# EAGLE design 2022-LPC2148_Piggyback_V1 (EAGLE 6.1)

## Sheet 1 of 3
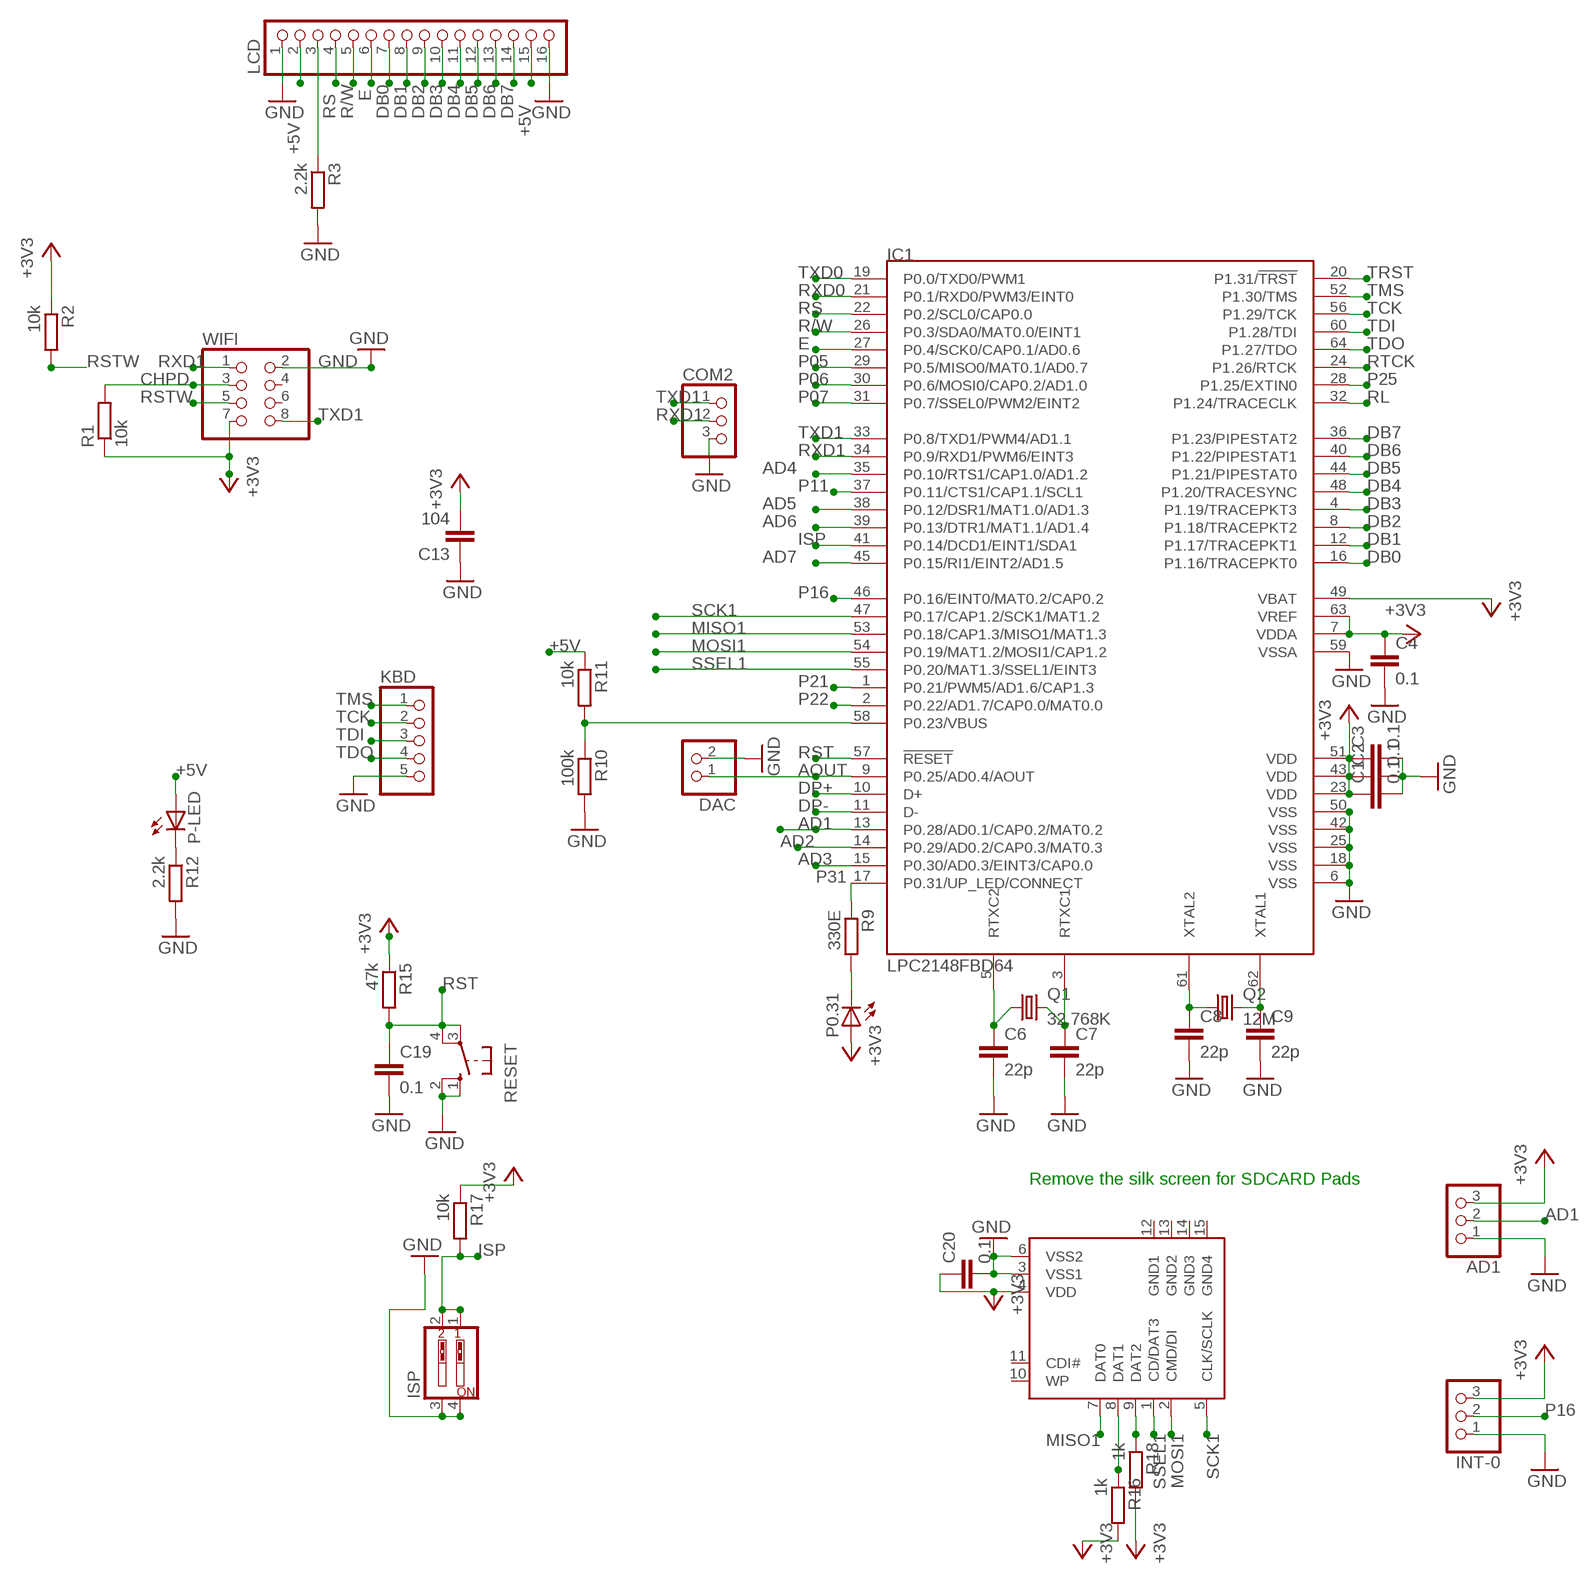
[diagram p0: schematic, sheet 1]

### Parts
AD1  PINHD-1X3  [1X03]
C1  0.1  C-EUC1206  [C1206]
C2  0.1  C-EUC1206  [C1206]
C3  0.1  C-EUC1206  [C1206]
C4  0.1  C-EUC1206  [C1206]
C6  22p  C-EUC1206  [C1206]
C7  22p  C-EUC1206  [C1206]
C8  22p  C-EUC1206  [C1206]
C9  22p  C-EUC1206  [C1206]
C13  104  C-EUC1206  [C1206]
C19  0.1  C-EUC1206  [C1206]
C20  0.1  C-EUC1206  [C1206]
COM2  PINHD-1X3  [1X03]
DAC  PINHD-1X2  [1X02]
IC1  LPC2148FBD64  [TSQFP50P1200X1200X160-64N]
INT-0  PINHD-1X3  [1X03]
ISP  SW_DIP-2  [EDG-02]
KBD  PINHD-1X5  [1X05]
LCD  PINHD-1X16  [1X16]
P0.31  LEDCHIPLED_1206  [CHIPLED_1206]
P-LED  LEDCHIPLED_1206  [CHIPLED_1206]
Q1  32.768K  CRYSTALTC26H  [TC26H]
Q2  12M  CRYSTALHC49U70  [HC49U70]
R1  10k  R-EU_R1206  [R1206]
R2  10k  R-EU_R1206  [R1206]
R3  2.2k  R-EU_R1206  [R1206]
R9  330E  R-EU_R1206  [R1206]
R10  100k  R-EU_R1206  [R1206]
R11  10k  R-EU_R1206  [R1206]
R12  2.2k  R-EU_R1206  [R1206]
R15  47k  R-EU_R1206  [R1206]
R16  1k  R-EU_R1206  [R1206]
R17  10k  R-EU_R1206  [R1206]
R18  1k  R-EU_R1206  [R1206]
RESET  10-XX  [B3F-10XX]
SD  SDCARDVAR2  [SDCMF-10915W010]
WIFI  PINHD-2X4  [2X04]

### Nets
+3V3: AD1.3 C1.1 C2.1 C3.1 C4.1 C13.2 C20.1 IC1.7(VDDA) IC1.23(VDD) IC1.43(VDD) IC1.49(VBAT) IC1.51(VDD) IC1.63(VREF) INT-0.3 P0.31.A R1.1 R2.1 R15.1 R16.2 R17.1 R18.2 SD.4(VDD) WIFI.7 ; also sheet 2,3
+5V: LCD.2 LCD.15 P-LED.A R11.1 ; also sheet 2,3
AD1: AD1.2 IC1.13(P0.28/AD0.1/CAP0.2/MAT0.2) ; also sheet 2
AD2: IC1.14(P0.29/AD0.2/CAP0.3/MAT0.3) ; also sheet 2
AD3: IC1.15(P0.30/AD0.3/EINT3/CAP0.0) ; also sheet 2
AD4: IC1.35(P0.10/RTS1/CAP1.0/AD1.2) ; also sheet 2
AD5: IC1.38(P0.12/DSR1/MAT1.0/AD1.3) ; also sheet 2
AD6: IC1.39(P0.13/DTR1/MAT1.1/AD1.4) ; also sheet 2
AD7: IC1.45(P0.15/RI1/EINT2/AD1.5) ; also sheet 2
AOUT: DAC.1 IC1.9(P0.25/AD0.4/AOUT)
CHPD: R1.2 WIFI.3
DB0: IC1.16(P1.16/TRACEPKT0) LCD.7 ; also sheet 2
DB1: IC1.12(P1.17/TRACEPKT1) LCD.8 ; also sheet 2
DB2: IC1.8(P1.18/TRACEPKT2) LCD.9 ; also sheet 2
DB3: IC1.4(P1.19/TRACEPKT3) LCD.10 ; also sheet 2
DB4: IC1.48(P1.20/TRACESYNC) LCD.11 ; also sheet 2
DB5: IC1.44(P1.21/PIPESTAT0) LCD.12 ; also sheet 2
DB6: IC1.40(P1.22/PIPESTAT1) LCD.13 ; also sheet 2
DB7: IC1.36(P1.23/PIPESTAT2) LCD.14 ; also sheet 2
DP+: IC1.10(D+) ; also sheet 2
DP-: IC1.11(D-) ; also sheet 2
E: IC1.27(P0.4/SCK0/CAP0.1/AD0.6) LCD.6 ; also sheet 2
GND: AD1.1 C1.2 C2.2 C3.2 C4.2 C6.2 C7.2 C8.2 C9.2 C13.1 C19.2 C20.2 COM2.3 DAC.2 IC1.6(VSS) IC1.18(VSS) IC1.25(VSS) IC1.42(VSS) IC1.50(VSS) IC1.59(VSSA) INT-0.1 ISP.3 ISP.4 KBD.5 LCD.1 LCD.16 R3.2 R10.2 R12.2 RESET.1(S) RESET.2(S1) SD.3(VSS1) SD.6(VSS2) WIFI.2 ; also sheet 2,3
ISP: IC1.41(P0.14/DCD1/EINT1/SDA1) ISP.1 ISP.2 R17.2
MISO1: IC1.53(P0.18/CAP1.3/MISO1/MAT1.3) SD.7(DAT0)
MOSI1: IC1.54(P0.19/MAT1.2/MOSI1/CAP1.2) SD.2(CMD/DI)
N$1: C6.1 IC1.5(RTXC2) Q1.1
N$2: C7.1 IC1.3(RTXC1) Q1.2
N$4: C8.1 IC1.61(XTAL2) Q2.1
N$5: C9.1 IC1.62(XTAL1) Q2.2
N$7: P0.31.C R9.2
N$8: P-LED.C R12.1
N$13: IC1.58(P0.23/VBUS) R10.1 R11.2
N$18: LCD.3 R3.1
N$20: R18.1 SD.9(DAT2)
N$25: R16.1 SD.8(DAT1)
P05: IC1.29(P0.5/MISO0/MAT0.1/AD0.7) ; also sheet 2
P06: IC1.30(P0.6/MOSI0/CAP0.2/AD1.0) ; also sheet 2
P07: IC1.31(P0.7/SSEL0/PWM2/EINT2) ; also sheet 2
P11: IC1.37(P0.11/CTS1/CAP1.1/SCL1) ; also sheet 2
P16: IC1.46(P0.16/EINT0/MAT0.2/CAP0.2) INT-0.2
P21: IC1.1(P0.21/PWM5/AD1.6/CAP1.3) ; also sheet 2
P22: IC1.2(P0.22/AD1.7/CAP0.0/MAT0.0) ; also sheet 2
P25: IC1.28(P1.25/EXTIN0) ; also sheet 2
P31: IC1.17(P0.31/UP_LED/CONNECT) R9.1
R/W: IC1.26(P0.3/SDA0/MAT0.0/EINT1) LCD.5
RL: IC1.32(P1.24/TRACECLK) ; also sheet 2
RS: IC1.22(P0.2/SCL0/CAP0.0) LCD.4 ; also sheet 2
RST: C19.1 IC1.57(!RESET) R15.2 RESET.3(P) RESET.4(P1)
RSTW: R2.2 WIFI.5
RTCK: IC1.24(P1.26/RTCK) ; also sheet 2
RXD0: IC1.21(P0.1/RXD0/PWM3/EINT0) ; also sheet 2,3
RXD1: COM2.2 IC1.34(P0.9/RXD1/PWM6/EINT3) WIFI.1
SCK1: IC1.47(P0.17/CAP1.2/SCK1/MAT1.2) SD.5(CLK/SCLK)
SSEL1: IC1.55(P0.20/MAT1.3/SSEL1/EINT3) SD.1(CD/DAT3)
TCK: IC1.56(P1.29/TCK) KBD.2 ; also sheet 2
TDI: IC1.60(P1.28/TDI) KBD.3 ; also sheet 2
TDO: IC1.64(P1.27/TDO) KBD.4 ; also sheet 2
TMS: IC1.52(P1.30/TMS) KBD.1 ; also sheet 2
TRST: IC1.20(P1.31/!TRST) ; also sheet 2
TXD0: IC1.19(P0.0/TXD0/PWM1) ; also sheet 2,3
TXD1: COM2.1 IC1.33(P0.8/TXD1/PWM4/AD1.1) WIFI.8
Unconnected: SD.10(WP) SD.11(CDI#) WIFI.4 WIFI.6

### Notes on the sheet
- Remove the silk screen for SDCARD Pads

## Sheet 2 of 3
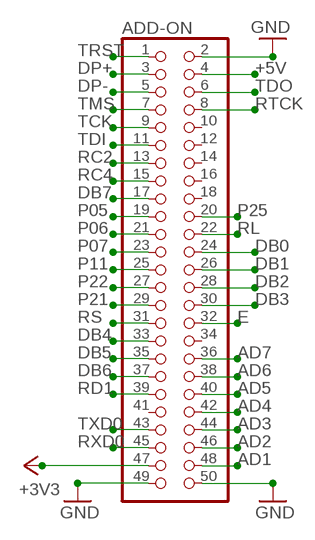
[diagram p1: schematic, sheet 2]

### Parts
ADD-ON  PINHD-2X25  [2X25]

### Nets
+3V3: ADD-ON.47 ; also sheet 1,3
+5V: ADD-ON.4 ; also sheet 1,3
AD1: ADD-ON.48 ; also sheet 1
AD2: ADD-ON.46 ; also sheet 1
AD3: ADD-ON.44 ; also sheet 1
AD4: ADD-ON.42 ; also sheet 1
AD5: ADD-ON.40 ; also sheet 1
AD6: ADD-ON.38 ; also sheet 1
AD7: ADD-ON.36 ; also sheet 1
DB0: ADD-ON.24 ; also sheet 1
DB1: ADD-ON.26 ; also sheet 1
DB2: ADD-ON.28 ; also sheet 1
DB3: ADD-ON.30 ; also sheet 1
DB4: ADD-ON.33 ; also sheet 1
DB5: ADD-ON.35 ; also sheet 1
DB6: ADD-ON.37 ; also sheet 1
DB7: ADD-ON.17 ; also sheet 1
DP+: ADD-ON.3 ; also sheet 1
DP-: ADD-ON.5 ; also sheet 1
E: ADD-ON.32 ; also sheet 1
GND: ADD-ON.2 ADD-ON.49 ADD-ON.50 ; also sheet 1,3
P05: ADD-ON.19 ; also sheet 1
P06: ADD-ON.21 ; also sheet 1
P07: ADD-ON.23 ; also sheet 1
P11: ADD-ON.25 ; also sheet 1
P21: ADD-ON.29 ; also sheet 1
P22: ADD-ON.27 ; also sheet 1
P25: ADD-ON.20 ; also sheet 1
RC2: ADD-ON.13
RC4: ADD-ON.15
RD1: ADD-ON.39
RL: ADD-ON.22 ; also sheet 1
RS: ADD-ON.31 ; also sheet 1
RTCK: ADD-ON.8 ; also sheet 1
RXD0: ADD-ON.45 ; also sheet 1,3
TCK: ADD-ON.9 ; also sheet 1
TDI: ADD-ON.11 ; also sheet 1
TDO: ADD-ON.6 ; also sheet 1
TMS: ADD-ON.7 ; also sheet 1
TRST: ADD-ON.1 ; also sheet 1
TXD0: ADD-ON.43 ; also sheet 1,3
Unconnected: ADD-ON.10 ADD-ON.12 ADD-ON.14 ADD-ON.16 ADD-ON.18 ADD-ON.34 ADD-ON.41

## Sheet 3 of 3
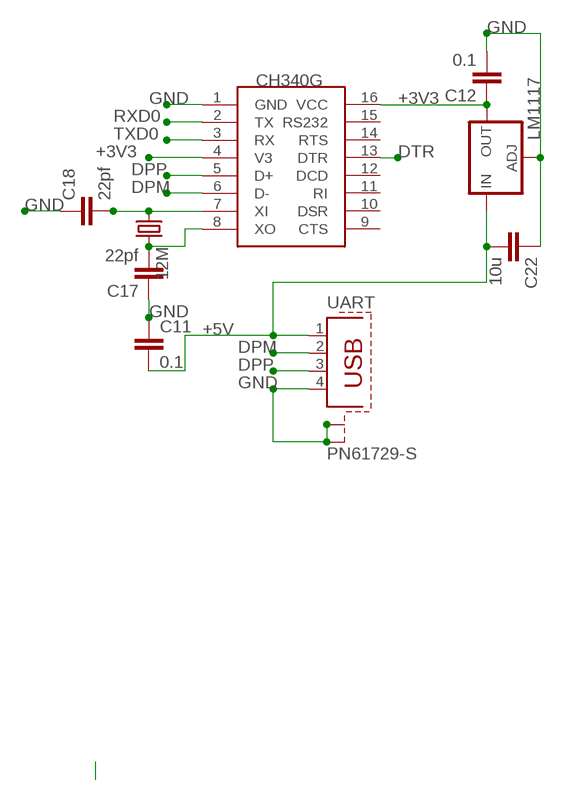
[diagram p2: schematic, sheet 3]

### Parts
12M  CRYSTALHC18U-V  [HC18U-V]
C11  0.1  C-EUC1206  [C1206]
C12  0.1  C-EUC1206  [C1206]
C17  22pf  C-EUC1206  [C1206]
C18  22pf  C-EUC1206  [C1206]
C22  10u  C-EUC1206  [C1206]
LM1117  LD117AS18TR  [SOT223]
U$1  CH340G  [SOIC16]
UART  PN61729-S  [PN61729-S]

### Nets
+3V3: C12.1 LM1117.4(OUT) U$1.4(V3) U$1.16(VCC) ; also sheet 1,2
+5V: C11.2 C22.2 LM1117.3(IN) UART.1 ; also sheet 1,2
DPM: U$1.6(D-) UART.2
DPP: U$1.5(D+) UART.3
DTR: U$1.13(DTR)
GND: C11.1 C12.2 C17.1 C18.1 C22.1 LM1117.1(ADJ) U$1.1(GND) UART.4 UART.S1 UART.S2 ; also sheet 1,2
N$10: 12M.2 C17.2 U$1.8(XO)
N$14: 12M.1 C18.2 U$1.7(XI)
RXD0: U$1.2(TX) ; also sheet 1,2
TXD0: U$1.3(RX) ; also sheet 1,2
Unconnected: U$1.9(CTS) U$1.10(DSR) U$1.11(RI) U$1.12(DCD) U$1.14(RTS) U$1.15(RS232)

## Power pins joined to a net without a drawn wire
GND1: SD.12(GND1)
GND2: SD.13(GND2)
GND3: SD.14(GND3)
GND4: SD.15(GND4)

## Library data of the parts
12M Q1 Q2 = crystal:CRYSTAL: CRYSTAL; OC_FARNELL: unknown; OC_NEWARK: unknown
AD1 COM2 INT-0 = pinhead:PINHD-1X3: PIN HEADER
ADD-ON = pinhead:PINHD-2X25: PIN HEADER
C1-C4 C6-C9 C11-C13 C17-C20 C22 = resistor:C-EU: CAPACITOR, European symbol
DAC = pinhead:PINHD-1X2: PIN HEADER
IC1 = nxp:LPC2148
ISP = special:SW_DIP-2: DIP SWITCH
KBD = pinhead:PINHD-1X5: PIN HEADER
LCD = pinhead:PINHD-1X16: PIN HEADER
LM1117 = v-reg:LD117A?*: Low drop fixed and adjustable positive voltage regulators 1 A Source: http://www.st.com/stonline/products/literature/ds/7194/ld1117axx.pdf
P0.31 P-LED = led:LED: LED OSRAM: - CHIPLED LG R971, LG N971, LY N971, LG Q971, LY Q971, LO R971, LY R971 LH N974, LH R974 LS Q976, LO Q976, LY Q976 LO Q996 - Hyper CHIPLED LW Q18S LB Q993, LB Q99A, LB R99A - SideLED LS A670, LO A670, LY A670, LG A670, LP A670 LB A673, LV A673, LT A673, LW A673 LH A674 LY A675 LS A676, LA A676, LO A676, LY A676, LW A676 LS A679, LY A679, LG A679 - Hyper Micro SIDELED® LS Y876, LA Y876, LO Y876, LY Y876 LT Y87S - SmartLED LW L88C, LW L88S LB L89C, LB L89S, LG L890 LS L89K, LO L89K, LY L89K LS L896, LA L896, LO L896, LY L896 - TOPLED LS T670, LO T670, LY T670, LG T670, LP T670 LSG T670, LSP T670, LSY T670, LOP T670, LYG T670 LG T671, LOG T671, LSG T671 LB T673, LV T673, LT T673, LW T673 LH T674 LS T676, LA T676, LO T676, LY T676, LB T676, LH T676, LSB T676, LW T676 LB T67C, LV T67C, LT T67C, LS T67K, LO T67K, LY T67K, LW E67C LS E67B, LA E67B, LO E67B, LY E67B, LB E67C, LV E67C, LT E67C LW T67C LS T679, LY T679, LG T679 LS T770, LO T770, LY T770, LG T770, LP T770 LB T773, LV T773, LT T773, LW T773 LH T774 LS E675, LA E675, LY E675, LS T675 LS T776, LA T776, LO T776, LY T776, LB T776 LHGB T686 LT T68C, LB T68C - Hyper Mini TOPLED® LB M676 - Mini TOPLED Santana® LG M470 LS M47K, LO M47K, LY M47K Source: http://www.osram.convergy.de LUXEON: - LUMILED® LXK2-PW12-R00, LXK2-PW12-S00, LXK2-PW14-U00, LXK2-PW14-V00 LXK2-PM12-R00, LXK2-PM12-S00, LXK2-PM14-U00 LXK2-PE12-Q00, LXK2-PE12-R00, LXK2-PE12-S00, LXK2-PE14-T00, LXK2-PE14-U00 LXK2-PB12-K00, LXK2-PB12-L00, LXK2-PB12-M00, LXK2-PB14-N00, LXK2-PB14-P00, LXK2-PB14-Q00 LXK2-PR12-L00, LXK2-PR12-M00, LXK2-PR14-Q00, LXK2-PR14-R00 LXK2-PD12-Q00, LXK2-PD12-R00, LXK2-PD12-S00 LXK2-PH12-R00, LXK2-PH12-S00 LXK2-PL12-P00, LXK2-PL12-Q00, LXK2-PL12-R00 Source: www.luxeon.com KINGBRIGHT: KA-3528ASYC Source: www.kingbright.com
R1-R3 R9-R12 R15-R18 = resistor:R-EU_: RESISTOR, European symbol
RESET = switch-omron:10-XX: OMRON SWITCH; MPN: B3F-1000; OC_FARNELL: 176432; OC_NEWARK: 36M3542
SD = kingfont_sdcmf10915w010_covek:SDCARD: SD card connector KINGFONT SDCMF-10915W010
U$1 = ch340g:CH340G
UART = con-berg:PN61729-S: BERG USB connector
WIFI = pinhead:PINHD-2X4: PIN HEADER

## Board
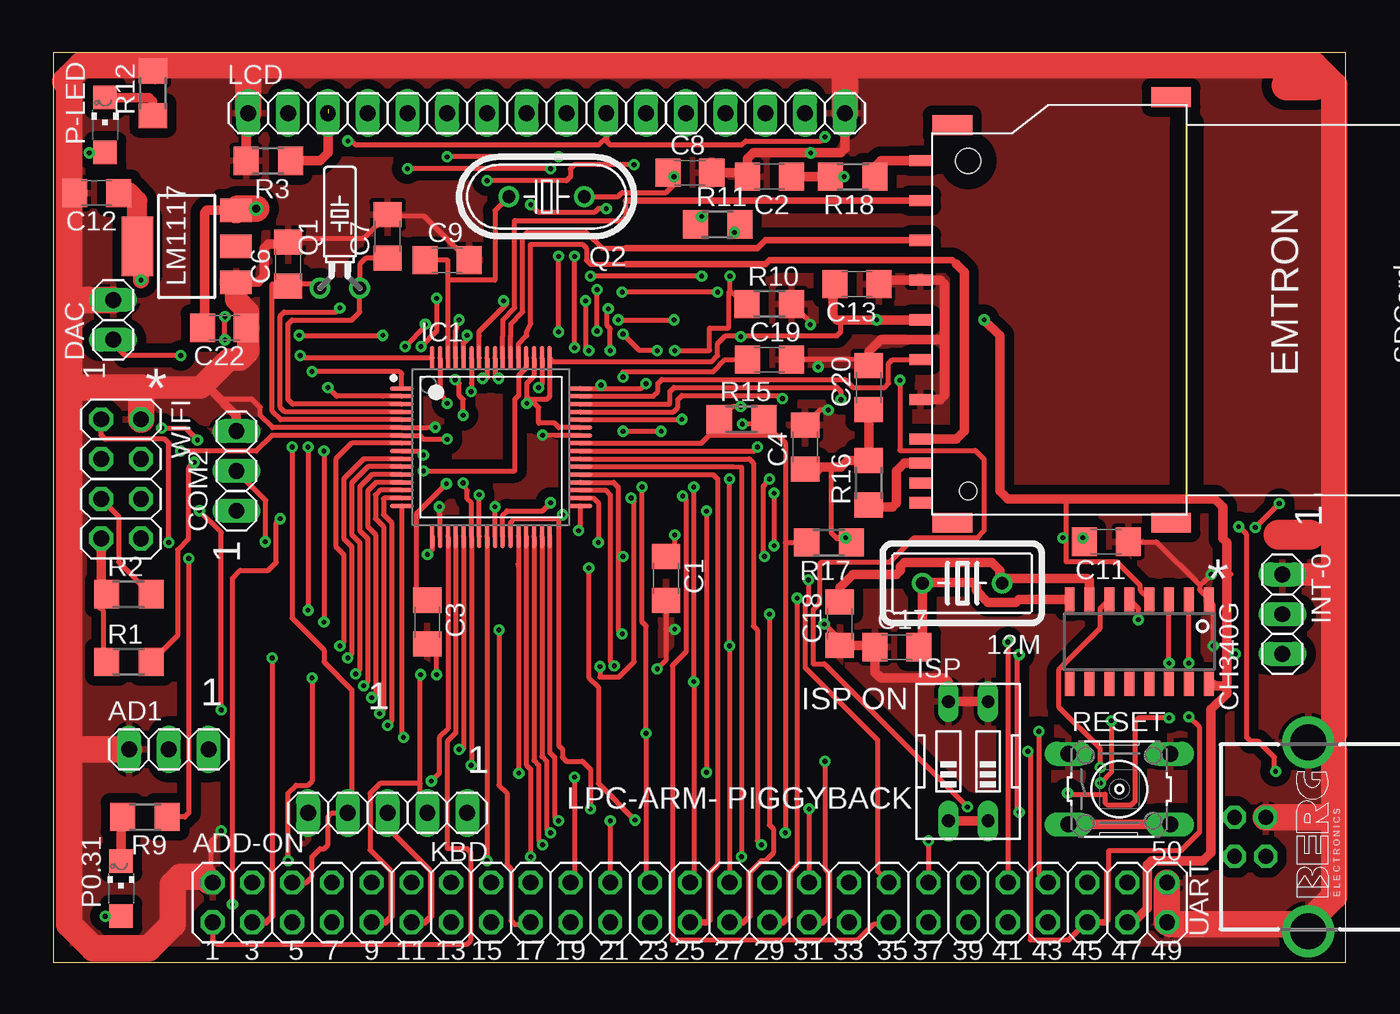
[diagram p3: board, top side]
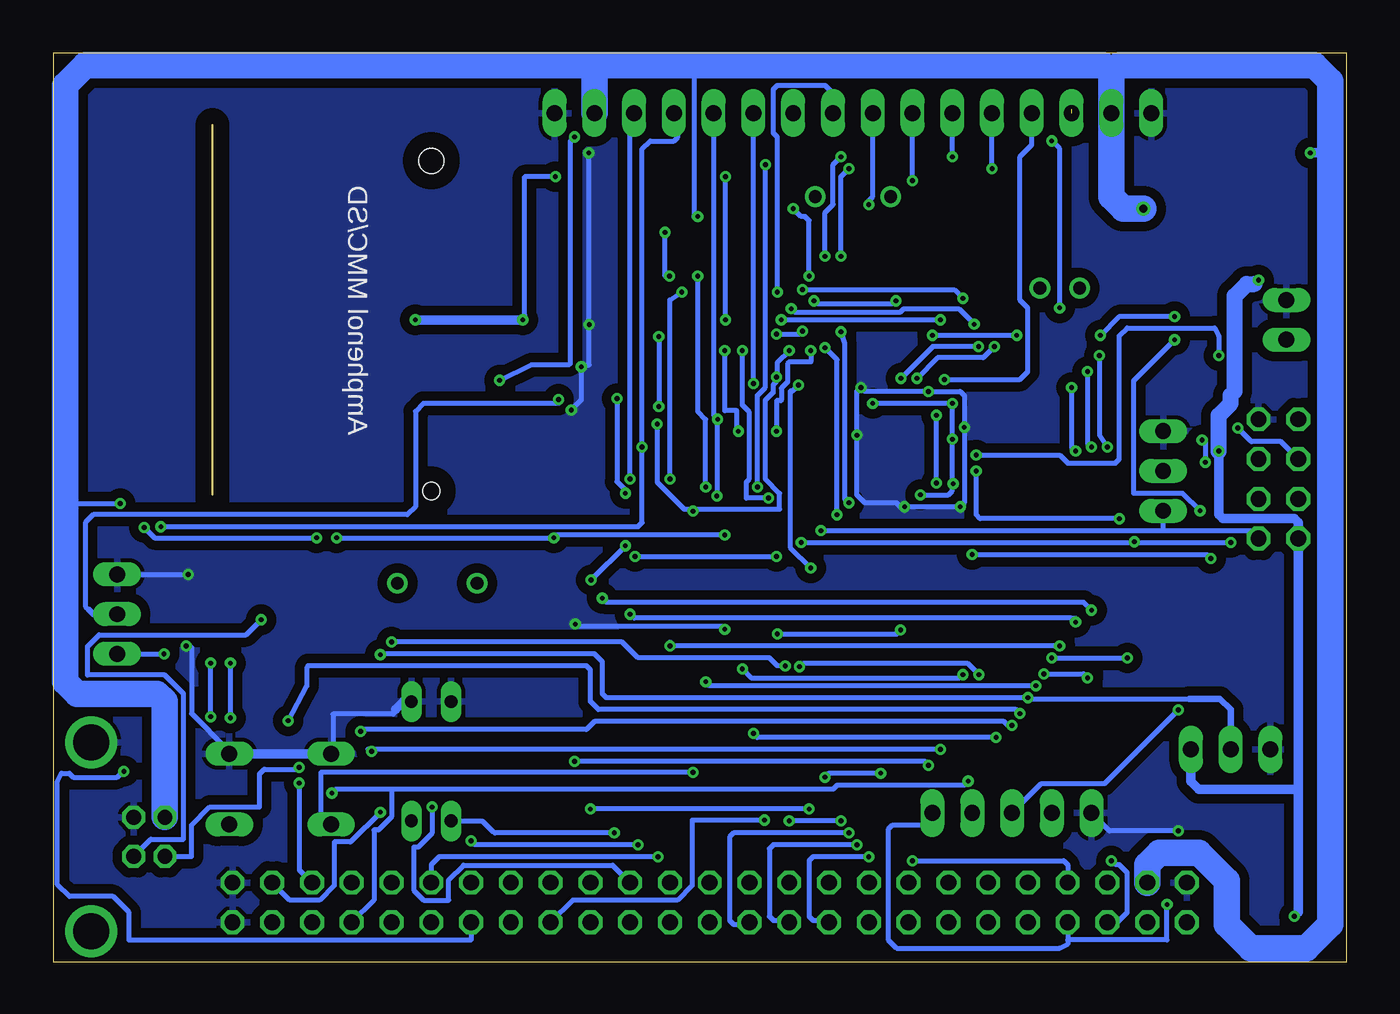
[diagram p4: board, bottom side, seen from below]

Size 82.53 x 58.09 mm. Coordinates in mm from the lower left corner, seen from the top.
Outline: 0,0 82.53,0 82.53,58.09 0,58.09 0,0
Copper layers (1*16): Top 0.035mm / dielectric 1.5mm / Bottom 0.035mm
Design rules: minimum track width 12mil, minimum drill 12mil, track to track 8mil, track to pad 8mil, pad to pad 8mil, via to via 8mil, smd to smd 8mil, copper to edge 40mil, drill to drill 8mil, minimum pad ring 10mil, minimum via ring 8mil, stop-mask expansion 4mil, vias tented up to drill 0mil, thermal gap 10mil

### Footprints (pad centres in the part's own frame; a part is rotated, then mirrored left to right if it is on the bottom)
HC18U-V = drill 0.813: 1 -2.54,0; 2 2.54,0
1X03 = drill 1.016 long: 1 -2.54,0; 2 0,0; 3 2.54,0
2X25 = drill 1.016 octagon: 1 -30.48,-1.27; 2 -30.48,1.27; 3 -27.94,-1.27; 4 -27.94,1.27; 5 -25.4,-1.27; 6 -25.4,1.27; 7 -22.86,-1.27; 8 -22.86,1.27; 9 -20.32,-1.27; 10 -20.32,1.27; 11 -17.78,-1.27; 12 -17.78,1.27; 13 -15.24,-1.27; 14 -15.24,1.27; 15 -12.7,-1.27; 16 -12.7,1.27; 17 -10.16,-1.27; 18 -10.16,1.27; 19 -7.62,-1.27; 20 -7.62,1.27; 21 -5.08,-1.27; 22 -5.08,1.27; 23 -2.54,-1.27; 24 -2.54,1.27; 25 0,-1.27; 26 0,1.27; 27 2.54,-1.27; 28 2.54,1.27; 29 5.08,-1.27; 30 5.08,1.27; 31 7.62,-1.27; 32 7.62,1.27; 33 10.16,-1.27; 34 10.16,1.27; 35 12.7,-1.27; 36 12.7,1.27; 37 15.24,-1.27; 38 15.24,1.27; 39 17.78,-1.27; 40 17.78,1.27; 41 20.32,-1.27; 42 20.32,1.27; 43 22.86,-1.27; 44 22.86,1.27; 45 25.4,-1.27; 46 25.4,1.27; 47 27.94,-1.27; 48 27.94,1.27; 49 30.48,-1.27; 50 30.48,1.27
C1206 = smd 1.6 x 1.8: 1 -1.4,0; 2 1.4,0
1X02 = drill 1.016 long: 1 -1.27,0; 2 1.27,0
TSQFP50P1200X1200X160-64N = smd 1.55 x 0.3: 1 -5.7,3.75; 2 -5.7,3.25; 3 -5.7,2.75; 4 -5.7,2.25; 5 -5.7,1.75; 6 -5.7,1.25; 7 -5.7,0.75; 8 -5.7,0.25; 9 -5.7,-0.25; 10 -5.7,-0.75; 11 -5.7,-1.25; 12 -5.7,-1.75; 13 -5.7,-2.25; 14 -5.7,-2.75; 15 -5.7,-3.25; 16 -5.7,-3.75; 33 5.7,-3.75; 34 5.7,-3.25; 35 5.7,-2.75; 36 5.7,-2.25; 37 5.7,-1.75; 38 5.7,-1.25; 39 5.7,-0.75; 40 5.7,-0.25; 41 5.7,0.25; 42 5.7,0.75; 43 5.7,1.25; 44 5.7,1.75; 45 5.7,2.25; 46 5.7,2.75; 47 5.7,3.25; 48 5.7,3.75 | smd 0.3 x 1.55: 17 -3.75,-5.7; 18 -3.25,-5.7; 19 -2.75,-5.7; 20 -2.25,-5.7; 21 -1.75,-5.7; 22 -1.25,-5.7; 23 -0.75,-5.7; 24 -0.25,-5.7; 25 0.25,-5.7; 26 0.75,-5.7; 27 1.25,-5.7; 28 1.75,-5.7; 29 2.25,-5.7; 30 2.75,-5.7; 31 3.25,-5.7; 32 3.75,-5.7; 49 3.75,5.7; 50 3.25,5.7; 51 2.75,5.7; 52 2.25,5.7; 53 1.75,5.7; 54 1.25,5.7; 55 0.75,5.7; 56 0.25,5.7; 57 -0.25,5.7; 58 -0.75,5.7; 59 -1.25,5.7; 60 -1.75,5.7; 61 -2.25,5.7; 62 -2.75,5.7; 63 -3.25,5.7; 64 -3.75,5.7
EDG-02 = drill 0.813 long: 1 -1.27,-3.81; 2 1.27,-3.81; 3 1.27,3.81; 4 -1.27,3.81
1X05 = drill 1.016 long: 1 -5.08,0; 2 -2.54,0; 3 0,0; 4 2.54,0; 5 5.08,0
1X16 = drill 1.016 long: 1 -19.05,0; 2 -16.51,0; 3 -13.97,0; 4 -11.43,0; 5 -8.89,0; 6 -6.35,0; 7 -3.81,0; 8 -1.27,0; 9 1.27,0; 10 3.81,0; 11 6.35,0; 12 8.89,0; 13 11.43,0; 14 13.97,0; 15 16.51,0; 16 19.05,0
SOT223 = smd 1.5 x 2: 1 -2.3,-3.15; 2 0,-3.15; 3 2.3,-3.15 | smd 3.8 x 2: 4 0,3.15
CHIPLED_1206 = smd 1.5 x 1.5: A 0,-1.75; C 0,1.75
TC26H = drill 0.813: 1 -1.27,0; 2 1.27,0
HC49U70 = drill 0.813: 1 -2.413,0; 2 2.413,0
R1206 = smd 1.6 x 1.803: 1 -1.422,0; 2 1.422,0
B3F-10XX = drill 1.016 long: 1 -3.251,2.261; 2 3.251,2.261; 3 -3.251,-2.261; 4 3.251,-2.261
SDCMF-10915W010 = smd 0.711 x 1.422: 1 7.366,13.462; 2 4.826,13.462; 3 2.286,13.462; 4 -0.254,13.462; 5 -2.794,13.462; 6 -5.334,13.462; 7 -7.874,13.462; 8 -9.398,13.462; 9 9.906,13.462; 10 -11.938,13.462; 11 -10.668,13.462 | smd 1.27 x 2.54: 12 12.192,11.43; 13 13.97,-2.54; 14 -13.208,-2.54; 15 -13.208,11.43 | hole 1.6: 9.906,10.414 | hole 1.1: -11.176,10.414
SOIC16 = smd 0.635 x 1.524: 1 -4.445,-2.695; 2 -3.175,-2.695; 3 -1.905,-2.695; 4 -0.635,-2.695; 5 0.635,-2.695; 6 1.905,-2.695; 7 3.175,-2.695; 8 4.445,-2.695; 9 4.445,2.695; 10 3.175,2.695; 11 1.905,2.695; 12 0.635,2.695; 13 -0.635,2.695; 14 -1.905,2.695; 15 -3.175,2.695; 16 -4.445,2.695
PN61729-S = drill 0.95 octagon: 1 1.25,4.71; 2 -1.25,4.71; 3 -1.25,2.71; 4 1.25,2.71 | drill 2.3 pad 2.9: S1 -6.02,0; S2 6.02,0
2X04 = drill 1.016 octagon: 1 -3.81,-1.27; 2 -3.81,1.27; 3 -1.27,-1.27; 4 -1.27,1.27; 5 1.27,-1.27; 6 1.27,1.27; 7 3.81,-1.27; 8 3.81,1.27

### Placement (x,y rotation side)
12M  58.04,24.21 180 top
AD1  7.37,13.59 0 top
ADD-ON  40.64,3.81 0 top
C1  39.12,24.51 270 top
C2  45.72,50.16 180 top
C3  23.88,21.72 270 top
C4  48.01,32.89 90 top
C6  14.99,44.58 90 top
C7  21.34,46.36 90 top
C8  40.64,50.42 0 top
C9  25.15,44.83 0 top
C11  67.23,26.85 180 top
C12  2.77,49.12 180 top
C13  51.31,43.31 180 top
C17  53.87,20.12 0 top
C18  50.22,21.62 90 top
C19  45.72,38.48 0 top
C20  52.07,36.7 90 top
C22  10.92,40.51 180 top
COM2  11.68,31.37 90 top
DAC  3.81,41.02 90 top
IC1  27.94,32.89 0 top
INT-0  78.49,22.23 270 top
ISP  58.42,12.83 0 top
KBD  21.34,9.52 180 top
LCD  31.5,54.23 0 top
LM1117  8.51,45.72 90 top
P0.31  4.32,4.7 0 top
P-LED  3.3,53.47 0 top
Q1  18.29,43.05 0 top
Q2  31.5,48.89 180 top
R1  4.83,19.18 0 top
R2  4.83,23.49 0 top
R3  13.72,51.18 180 top
R9  5.84,9.27 180 top
R10  45.72,42.04 0 top
R11  42.42,47.12 0 top
R12  6.35,55.5 90 top
R15  43.94,34.67 0 top
R16  52.07,30.61 90 top
R17  49.53,26.8 180 top
R18  51.05,50.16 180 top
RESET  68.07,11.05 0 top
SD  68.83,41.27 90 top
U$1  69.34,20.47 180 top
UART  80.14,8 90 top
WIFI  4.32,30.86 270 top

### Tracks (layer width: path | path; a pad name or v marks a point on that pad's centre or on a via)
+3V3  (via drill 0.3)
  Top 0.305: 17.28,33.64 IC1.7 23.36,33.64 23.37,33.66 23.62,33.4 v25.15,33.4 | 17.28,33.64 17.27,33.66 | IC1.23 27.19,29.58 v27.18,29.84 | IC1.43 32.28,34.14 32,34.42 30.99,34.42 30.99,35.43 30.48,35.94 | IC1.63 24.69,36.4 v25.15,35.69 | IC1.51 30.69,37.42 30.23,36.96 v30.23,35.69 30.35,36.02 30.48,35.94 | 30.48,35.94 31.5,35.94 31.69,36.13 IC1.49 31.7,38.58 31.75,38.48 31.89,38.34 42.02,38.34 42.42,38.73 42.42,39.5 42.93,40 43.89,40 | 43.89,40 50.04,40 50.29,40.26 50.29,40.77 50.04,41.02 | 17.28,33.64 13.96,33.64 12.95,32.64 v8.13,32.64 | 5.59,45.49 LM1117.4 | v25.09,30.56 23.16,28.63 23.16,23.85 23.88,23.14 C3.1 | R2.1 | R2.1 3.48,23.57 | v39.68,27.28 39.68,26.49 39.12,25.93 C1.1 | v50.6,27.1 50.93,27.1 50.93,26.8 R17.1 | 50.67,27.23 v50.6,27.1 | 64.67,29.59 64.67,27.1 | 64.67,27.1 64.67,25.58 67.89,25.58 69.39,24.08 69.39,23.77 69.98,23.19 U$1.4 | v43.89,35.48 43.36,35.48 42.55,34.67 R15.1 | v43.89,39.95 43.89,40 | v50.5,50.16 50.34,50.16 49.94,50.06 R18.2 | 75.21,24.77 74.93,24.77 | v64.47,27.1 64.67,27.1 | 49.66,31.62 49.66,27.43 50.04,27.05 | 50.04,27.05 50.55,27.05 | v50.6,27.1 50.09,27.1 50.04,27.05 | R1.1 3.17,19.41 3.17,22.45 3.05,22.73 | R1.1 | v75.49,19.69 74.93,19.69
  Top 0.61: R18.2 C2.1 | SD.4 v52.58,41.02 50.04,41.02 49.78,41.27 49.78,43.43 | 49.78,43.81 49.78,43.43 | 49.78,43.43 C13.2 | C20.1 R16.2 50.7,32.03 50.29,31.62 49.66,31.62 49.02,31.62 48.77,31.37 48.13,31.37 C4.1 | ADD-ON.47 68.96,2.54 69.85,3.43 69.85,6.22 70.1,6.48 73.41,6.48 73.91,6.98 73.91,16.13 74.93,17.15 74.93,17.65 | 74.93,17.65 74.93,19.69 74.93,24.77 74.93,26.8 74.68,27.05 74.68,29.08 74.17,29.59 64.67,29.59 60.96,29.59 60.45,30.1 60.45,40 v59.44,41.02 | U$1.16 74.04,17.78 74.17,17.65 74.93,17.65 | 3.05,22.73 3.56,23.24 3.56,23.49 3.48,23.57 3.05,24 WIFI.7 | v3.3,2.92 4.32,2.92 P0.31.A
  Top 1.016: v5.59,43.56 5.59,45.49
  Top 1.27: LM1117.4 5.36,48.62 4.83,49.15 4.19,49.15 C12.1
  Bottom 0.305: v27.18,29.84 25.4,29.84 25.15,30.1 25.15,30.56 | 25.15,30.56 v25.15,33.4 v25.15,35.69 v30.23,35.69 | 7.37,36.2 7.11,36.45 | 5.84,43.31 v5.59,43.56 | v25.09,30.56 25.15,30.56 | v39.68,27.28 39.7,27.3 50.39,27.3 v50.6,27.1 v64.47,27.1 | v43.89,39.95 v43.89,35.48 | v52.58,41.02 52.45,41.3 52.45,50.16 v50.5,50.16 | INT-0.3 v75.49,19.69
  Bottom 0.61: v59.44,41.02 v52.58,41.02 | 3.05,11.05 WIFI.7 3.05,28.07 3.3,28.32 7.87,28.32 8.13,28.57 v8.13,32.64 | 3.05,11.05 3.05,3.17 v3.3,2.92 | AD1.3 9.91,11.56 9.4,11.05 3.05,11.05
  Bottom 1.016: v8.13,32.64 8.13,34.92 7.37,35.69 7.37,36.2 | 7.11,36.45 7.11,42.55 6.35,43.31 5.84,43.31
+5V  (via drill 0.3, 0.5)
  Top 0.305: v41.4,47.62 41.4,47.52 R11.1 | v65.73,27.1 C11.2 | v78.28,29.29 v76.76,27.76
  Top 0.61: LM1117.3 9.79,48.02 9.65,47.88 9.65,40.64 C22.2 | P-LED.A 2.31,51.72 v2.29,51.69
  Top 1.676: v12.95,48.13 11.77,48.13 LM1117.3
  Bottom 0.305: 41.66,56.77 41.66,47.62 v41.4,47.62 | v65.73,27.1 76.1,27.1 v76.76,27.76 | 81.79,29.29 v78.28,29.29 | UART.1 75.44,9.27
  Bottom 0.61: 41.66,56.77 42.16,57.28 | v2.29,51.69 1.02,51.69
  Bottom 1.676: 14.99,56.77 LCD.2 14.99,48.89 14.22,48.13 v12.95,48.13 | 14.99,56.77 15.49,57.28 42.16,57.28 48.26,57.28 | 48.26,57.28 80.52,57.28 81.79,56.01 81.79,29.29 81.79,17.91 81.03,17.15 75.95,17.15 75.44,16.64 75.44,9.27 | LCD.15 48.01,57.02 48.26,57.28 | ADD-ON.4 12.7,6.22 11.94,6.98 9.4,6.98 7.62,5.21 7.62,2.41 6.1,0.89 2.54,0.89 1.02,2.41 1.02,51.69 1.02,56.26 2.03,57.28 14.48,57.28 14.99,56.77
AD1  (via drill 0.3)
  Top 0.305: IC1.13 20.61,30.64 20.07,30.1 20.07,27.81 20.57,27.3 20.57,17.15 v20.32,16.89 | v61.67,9.58 61.52,9.73 61.52,19.48 v61.67,19.63
  Bottom 0.305: 10.01,16.81 20.19,16.81 v20.32,16.89 47.24,16.89 47.5,17.15 47.5,19.18 48.01,19.69 61.67,19.69 v61.67,19.63 | ADD-ON.48 67.46,3.96 65.56,3.96 64.62,4.9 64.62,7.67 63.58,7.67 v61.67,9.58
  Bottom 0.406: 10.01,16.81 8.05,16.81 7.37,16.13 AD1.2
AD2  (via drill 0.3)
  Top 0.305: IC1.14 20.87,30.14 20.57,29.84 20.57,28.32 21.08,27.81 21.08,16.13 v20.83,15.88 | v66.85,11.43 67.56,12.14 v67.56,15.42
  Bottom 0.305: v20.83,15.88 21.08,16.13 47.75,16.13 48.26,16.64 48.26,18.67 48.51,18.92 66.29,18.92 66.37,18.8 66.37,17.63 v67.56,15.42 | ADD-ON.46 66.85,5.89 v66.85,11.43
AD3  (via drill 0.3)
  Top 0.305: IC1.15 21.13,29.64 21.08,29.59 21.08,28.57 21.59,28.07 21.59,15.37 v21.34,15.11 | ADD-ON.44 62.94,5.64 v62.94,14.73
  Bottom 0.305: v21.34,15.11 21.59,15.11 21.84,15.37 48.01,15.37 48.51,14.86 62.94,14.86 v62.94,14.73
AD4  (via drill 0.3)
  Top 0.305: IC1.35 35.26,30.14 35.56,29.84 35.56,19.18 v35.81,18.92 | v60.96,20.45 60.96,5.21 | 60.96,5.21 61.21,4.95 | ADD-ON.42 60.96,5.21
  Bottom 0.305: v35.81,18.92 36.32,18.92 36.83,19.43 45.21,19.43 46.23,20.45 v60.96,20.45
AD5  (via drill 0.3)
  Top 0.305: IC1.38 43.41,31.64 43.94,31.62 v43.94,6.73
  Bottom 0.305: v43.94,6.73 57.91,6.73 58.42,6.22 ADD-ON.40
AD6  (via drill 0.3)
  Top 0.305: IC1.39 44.44,32.14 44.7,31.88 44.7,21.46 44.96,21.21 44.96,7.75 v45.21,7.49 | v55.88,7.75 ADD-ON.38
  Bottom 0.305: v45.21,7.49 55.63,7.49 v55.88,7.75
AD7  (via drill 0.3)
  Top 0.305: IC1.45 39.59,35.14 39.88,35.43 39.88,35.94 40.13,36.2 46.56,36.2 v46.56,35.99 | ADD-ON.36 52.63,5.79 52.63,14.2 48.01,18.82 48.01,22.73 48.21,22.94 v48.21,24.41 | v46.02,29.95 v46.02,26.59
  Bottom 0.305: v46.02,26.59 v48.21,24.41 | v46.02,29.95 46.02,30.15 46.56,30.68 v46.56,35.99
AOUT  (via drill 0.3)
  Top 0.305: IC1.9 23.36,32.64 v23.62,32.38 | v8.13,38.73 4.57,38.73 3.81,39.5 DAC.1
  Bottom 0.305: v23.62,32.38 18.29,32.38 17.78,31.88 14.73,31.88 14.48,32.13 14.48,40 13.97,40.51 8.38,40.51 8.13,40 v8.13,38.73
CHPD  (via drill 0.3)
  Top 0.305: R1.2 7.92,20.85 7.92,26.34 8.61,27.03 8.61,31.55 v8.99,31.93 | v9.19,33.35 8.43,34.11 v6.91,34.11 | R1.2
  Bottom 0.305: v8.99,31.93 8.99,33.35 v9.19,33.35 | v6.91,34.11 6.04,33.25 4.17,33.25 WIFI.3
DB0  (via drill 0.3)
  Top 0.305: IC1.16 22.24,14.46 v22.35,14.35 | v37.59,30.35 37.59,21.72 37.85,21.46 v37.85,14.6 37.85,5.46 38.1,5.21 ADD-ON.24 | v37.08,50.93 33.27,50.93 33.02,50.67 33.02,50.16 32.77,49.91 v27.69,49.91
  Bottom 0.305: v22.35,14.35 37.59,14.35 v37.85,14.6 | v37.59,30.35 37.59,36.2 37.08,36.7 v37.08,50.93 | v27.69,49.91 LCD.7
DB1  (via drill 0.3)
  Top 0.305: IC1.12 20.35,31.14 19.56,30.35 19.56,27.56 20.07,27.05 20.07,17.91 v19.81,17.65 | ADD-ON.26 40.89,5.33 v40.89,17.91 v40.89,30.35 | v41.4,43.81 v34.29,43.81 | v35.31,48.13 34.8,48.13 34.54,47.88 30.99,47.88 v30.48,48.39
  Bottom 0.305: v19.81,17.65 40.64,17.65 v40.89,17.91 | v40.89,30.35 40.89,34.67 41.4,35.18 v41.4,43.81 | v34.29,43.81 34.29,47.37 34.54,47.62 34.8,47.62 v35.31,48.13 | v30.48,48.39 30.48,48.64 30.23,48.89 LCD.8
DB2  (via drill 0.3)
  Top 0.305: IC1.8 19.05,33.14 18.03,32.13 18.03,26.54 18.54,26.03 18.54,20.45 v18.29,20.19 | ADD-ON.28 v43.18,20.19 v43.18,30.86 | v42.42,42.8 v36.32,42.8
  Bottom 0.305: v18.29,20.19 42.93,20.19 43.05,20.32 | 43.05,20.32 43.18,20.45 | v43.18,30.86 43.18,42.29 v42.42,42.8 | v36.32,42.8 36.32,52.7 36.58,52.96 36.58,55.75 36.32,56.01 33.27,56.01 32.77,55.5 LCD.9 | v43.18,20.19 43.05,20.32
DB3  (via drill 0.3)
  Top 0.305: 20.54,35.14 IC1.4 14.77,35.14 14.48,35.43 14.48,41.27 14.73,41.53 18.03,41.53 v18.29,41.78 | v18.8,52.45 19.05,52.45 19.3,52.2 34.8,52.2 35.31,52.7 LCD.10 35.31,52.45 35.56,52.2 43.94,52.2 44.2,52.45 49.02,52.45 v49.28,52.7 | v58.37,9.91 49.23,19.05 48.51,19.05 48.51,22.5 48.95,22.94 48.95,25.45 49.02,25.53 53.47,25.53 53.47,25.58 54.97,27.08 58.8,27.08 | 59.03,27.08 58.8,27.08 | v54.05,37.16 54.05,32.69 58.88,32.69 59.44,32.13 59.44,27.56 58.93,27.05 58.8,27.08
  Bottom 0.305: v18.29,41.78 18.29,51.94 v18.8,52.45 | ADD-ON.30 46.84,6.2 56.36,6.2 57.3,5.26 57.3,3.96 58.9,3.96 59.54,4.6 59.54,7.34 59.26,7.34 58.37,8.23 v58.37,9.91 | v54.05,37.16 52.05,38.15 49.66,38.15 49.53,38.23 49.53,52.45 v49.28,52.7
DB4  (via drill 0.3)
  Top 0.305: IC1.48 34.98,36.64 | 34.98,36.64 37.53,36.64 v37.85,36.96 | v37.14,9.07 34.8,11.41 34.8,17.58 34.19,18.19 v34.19,25.17 | v34.98,36.86 34.98,36.64
  Bottom 0.305: v37.85,36.96 LCD.11 | ADD-ON.33 49.38,3.96 42.7,3.96 41.76,4.9 41.76,9.07 v37.14,9.07 | v34.19,25.17 35.51,26.49 35.51,36.47 35.36,36.47 v34.98,36.86
DB5  (via drill 0.3)
  Top 0.305: IC1.44 39.6,34.64 v40.13,34.67 | v40.18,29.77 40.39,29.57 40.39,19.81 39.52,18.95 39.52,1.42 51.38,1.42 52.4,2.44 53.16,2.44 ADD-ON.35
  Bottom 0.305: LCD.12 40.39,34.92 v40.13,34.67 40.18,34.54 v40.18,29.77
DB6  (via drill 0.3)
  Top 0.305: IC1.40 44.71,32.64 v44.96,32.89 | v75.69,27.81 76.2,27.3 76.2,14.35 76.45,14.1 76.96,14.1 77.98,13.08 77.98,12.32 v78.05,12.19
  Bottom 0.305: LCD.13 42.67,53.98 42.67,52.7 42.93,52.45 44.45,52.45 44.96,51.94 v44.96,32.89 44.96,28.07 45.21,27.81 v75.69,27.81 | ADD-ON.37 55.88,1.4 77.72,1.4 77.72,3.17 78.74,4.19 81.53,4.19 82.3,4.95 82.3,11.56 82.04,12.06 81.53,12.06 81.28,11.81 78.49,11.81 78.08,12.22 | 78.08,12.22 77.98,12.32 | v78.05,12.19 78.08,12.22
DB7  (via drill 0.3)
  Top 0.305: v45.72,30.86 45.5,30.64 45.44,30.5 45.31,30.38 45.31,26.01 v45.41,25.91 | IC1.36 35.78,30.64 36.07,30.35 36.07,25.91 | 36.07,25.91 36.07,21.21 v36.32,20.95 | v28.45,21.21 28.45,11.3 28.96,10.8 28.96,6.22 29.21,5.97 29.21,2.67 29.46,2.41 30.23,2.41 30.3,2.54 ADD-ON.17 | v36.37,25.91 36.07,25.91
  Bottom 0.305: v45.72,30.86 45.72,53.98 LCD.14 | v36.32,20.95 28.7,20.95 v28.45,21.21 | v45.41,25.91 v36.37,25.91
DP+  (via drill 0.3)
  Top 0.305: IC1.10 19.82,32.14 18.54,30.86 18.54,27.05 19.05,26.54 19.05,19.69 v18.8,19.43 | v13.97,19.43 13.97,5.46
  Top 0.406: ADD-ON.3 13.59,2.54 13.97,2.92 13.97,5.46 13.97,5.97
  Bottom 0.305: v18.8,19.43 v13.97,19.43
DP-  (via drill 0.3)
  Top 0.305: IC1.11 20.09,31.64 19.05,30.61 19.05,27.3 19.56,26.8 19.56,18.67 v19.3,18.41 | v16.51,18.16 16.51,11.56 16.26,11.3 15.49,11.3 14.99,10.8 v14.99,6.48
  Bottom 0.305: v19.3,18.41 16.76,18.41 v16.51,18.16 | ADD-ON.5 14.6,2.54 13.97,3.17 13.97,5.71 14.48,6.22 14.73,6.22 v14.99,6.48
DPM  (via drill 0.3)
  Top 0.305: v66.85,12.45 66.85,13.64 64.21,16.28 64.21,18.69 66.85,21.34 66.85,22.58 U$1.6
  Bottom 0.305: UART.2 75.41,6.76 73.74,6.76 73.74,8.74 72.57,9.91 69.39,9.91 69.39,12.01 69.09,12.32 66.98,12.32 v66.85,12.45
DPP  (via drill 0.3)
  Top 0.305: v69.29,21.87 69.29,22.58 U$1.5
  Bottom 0.305: v69.29,21.87 70.26,20.9 79.63,20.9 80.37,20.17 80.37,18.34 75.44,18.34 74.24,17.15 74.24,7.85 76.33,7.85 77.42,6.76 UART.3
E  (via drill 0.3)
  Top 0.305: IC1.27 29.19,28.05 29.46,28.32 32.26,28.32 | v32.26,51.44 v25.15,51.44 | 32.26,28.32 32.26,13.84 32.51,13.59 32.51,13.08 32.77,12.83 33.78,12.83 34.29,12.32 v34.29,9.78 | v48.26,9.78 ADD-ON.32 | v33.27,39.24 v33.27,45.09 | 32.26,28.32 v32.51,28.57
  Bottom 0.305: 32.51,51.18 v32.26,51.44 32.77,50.93 32.77,48.39 33.27,47.88 v33.27,45.09 | v25.15,51.44 LCD.6 | v34.29,9.78 v48.26,9.78 | v32.51,28.57 32.51,38.48 v33.27,39.24
GND  (via drill 0.3)
  Top 0.305: IC1.50 31.19,36.91 v30.99,36.7 | IC1.59 26.69,36.98 v26.67,36.45 | v24.38,34.16 23.86,34.14 IC1.6 13.99,34.14 13.21,34.92 13.21,35.43 12.7,35.94 10.67,35.94 10.03,36.58 9.65,36.96 | IC1.18 24.69,28.52 v24.64,29.08 | IC1.42 32.02,33.64 v31.24,33.66 | IC1.25 28.19,28.57 v28.19,29.08 | v24.46,18.36 24.46,19.71 23.88,20.3 C3.2 | v38.56,18.72 39.12,19.28 39.12,21.26 | C1.2 39.12,21.26 | 48.84,38.48 51.79,38.48 C20.2 | 48.84,38.48 C19.2 | v49.48,35.25 48.95,35.25 48.01,34.31 C4.2 | 48.84,38.48 v48.84,38.02 | R10.2 48.34,40.84 v48.34,40.72 | R10.2 | 73.2,24.08 73.2,23.77 73.79,23.19 U$1.1 73.86,23.04 74.07,22.84 v74.07,20.19 | 73.2,24.08 70.43,26.85 C11.1 | C6.2 14.73,45.85 | UART.S1 80.01,2.41 | UART.S1 | C7.2 19.81,46.23 15.26,46.23 C6.2 | 25.91,45.47 C9.2 25.78,45.54 23.65,47.68 21.46,47.68 C7.2 | 21.39,47.9 C7.2 | ADD-ON.2 9.65,5.46 10.06,6.2 10.06,7.72 v10.72,8.38 | v39.68,21.26 39.12,21.26 | v49.23,21.59 50.09,20.73 50.09,20.5 C18.1 | v73.94,24.77 73.33,24.16 73.2,24.08
  Top 0.61: LCD.16 50.55,51.94 50.29,51.69 v48.36,51.69 44.7,51.69 44.32,51.3 C2.2 44.07,50.42 C8.2 | C13.1 52.96,43.56 SD.3 56.64,43.56 56.9,43.31 56.9,40 | SD.6 56.64,35.94 56.9,36.2 56.9,40 | C20.2 52.07,38.99 52.83,39.75 56.64,39.75 56.9,40 | R3.2 12.29,54.08 LCD.1 | LM1117.1 13.07,43.42 13.46,43.81 13.46,45.59 13.72,45.85 14.73,45.85 14.99,46.1 C6.2 14.99,45.85 | R12.2 2.13,56.92 1.78,57.28 | C18.1 52.38,20.21 C17.1 52.47,18.52 52.83,18.16 56.9,18.16 57.15,17.91 ISP.4 ISP.3 | COM2.3 11.68,34.92 10.03,36.58
  Top 1.27: C12.2 1.37,48.99 1.02,48.64
  Top 1.422: LM1117.1 11.66,42.32 12.45,41.53 12.45,40.64 C22.1 12.45,40.39 12.45,38.99 11.94,38.48 11.18,38.48 9.65,36.96 9.4,36.7 5.59,36.7 | INT-0.1 81.53,24.77 81.79,24.51
  Top 1.676: UART.S2 81.2,14.02 | 81.2,14.02 81.79,14.6 81.79,24.51 81.79,56.01 80.52,57.28 50.8,57.28 | 50.8,57.28 12.45,57.28 | 12.45,57.28 1.78,57.28 1.02,56.52 | 0.76,56.26 1.02,56.52 | 1.02,56.52 1.02,48.64 1.02,42.55 | 1.02,42.55 1.02,36.45 | 1.02,36.45 1.02,13.59 | 1.02,13.59 1.02,2.41 2.54,0.89 6.1,0.89 7.62,2.41 7.62,4.95 8.13,5.46 9.65,5.46 9.91,5.21 | ADD-ON.49 ADD-ON.50 71.12,2.67 71.37,2.41 80.01,2.41 81.79,4.19 81.79,9.78 | 81.79,9.78 81.79,13.44 81.2,14.02 | UART.4 81.26,9.25 81.79,9.78 | AD1.1 1.02,13.59 | WIFI.2 5.59,36.7 1.27,36.7 1.02,36.45 | DAC.2 1.27,42.29 1.02,42.55 | LCD.1 12.45,57.28 | LCD.16 50.55,57.02 50.8,57.28
  Bottom 0.305: v24.64,29.08 24.38,29.34 v24.38,34.16 24.38,36.2 24.64,36.45 v26.67,36.45 30.73,36.45 v30.99,36.7 31.24,36.45 v31.24,33.66 31.24,29.84 30.73,29.34 28.7,29.34 28.45,29.08 | v24.64,29.08 24.89,29.08 | 24.89,29.08 v28.19,29.08 | v28.19,29.08 28.45,29.08 | v24.64,29.08 24.64,28.83 24.89,29.08 | v28.19,29.08 28.19,28.83 28.45,29.08 | v24.46,18.36 24.66,18.16 38,18.16 v38.56,18.72 | v49.48,35.25 48.84,35.89 v48.84,38.02 48.77,38.15 48.34,38.15 v48.34,40.72 48.36,40.84 v48.36,51.69 | RESET.1 64.69,13.59 64.69,15.85 60.83,15.85 60.71,16.13 | KBD.5 15.11,8.38 v10.72,8.38 | RESET.2 71.45,13.59 73.74,15.88 73.74,20.12 73.94,20.12 v74.07,20.19 | v39.68,21.26 39.88,21.46 49.1,21.46 v49.23,21.59 | INT-0.1 v73.94,24.77
  Bottom 0.61: RESET.2 RESET.1 | ISP.3 60.2,16.64 60.71,16.13
  pour Bottom (isolate 0.61): 0.51,57.53 82.3,57.53 82.3,0.38 0.51,0.38
  pour Top (isolate 0.61): 0.25,57.78 82.3,57.78 82.3,0.38 0.25,0.38
ISP  (via drill 0.3)
  Top 0.305: IC1.41 41.4,33.14 41.91,33.66 46.23,33.66 46.74,33.15 46.74,26.8 | 46.74,26.8 v46.74,8.26 | 46.74,26.8 R17.2
  Top 0.61: ISP.1 ISP.2
  Bottom 0.305: v46.74,8.26 54.36,8.26 54.48,8.33 55.17,9.02 ISP.1
MISO1
  Top 0.305: IC1.53 29.69,39.47 30.23,40 30.23,40.26 30.48,40.77 30.48,45.85 33.78,45.85 34.04,45.59 34.04,44.83 34.29,44.58 36.83,44.58
  Top 0.406: 57.66,44.58 57.4,44.83 45.72,44.83 45.47,44.58 36.83,44.58 36.58,44.58
  Top 0.61: SD.7 57.66,33.4 58.17,33.91 58.17,44.07 57.66,44.58
MOSI1
  Top 0.305: IC1.54 29.19,39.98 29.21,40 29.21,40.77 29.97,41.53 29.97,46.36 30.23,46.61 34.04,46.61 35.05,45.59 36.58,45.59
  Top 0.406: SD.2 45.47,46.1 44.96,45.59 36.58,45.59
N$1
  Top 0.305: IC1.5 14.51,34.64 13.97,35.18 13.97,43.31 15.12,43.31 | Q1.1 16.76,43.31 15.12,43.31 | 15.12,43.31 C6.1
N$2
  Top 0.305: IC1.3 15.28,35.64 14.99,35.94 14.99,40.77 15.24,41.02 19.05,41.02 19.56,41.53 Q1.2 19.56,44.58 19.94,44.95 C7.1
N$4  (via drill 0.3)
  Top 0.305: Q2.1 36.07,48.89 36.32,49.15 39.12,49.15 39.37,49.4 | 39.37,49.4 39.37,49.91 39.12,50.16 39.12,50.42 C8.1 | IC1.61 25.69,40.3 v25.91,41.02 | v36.07,41.02 v39.62,41.02 | v39.62,50.16 39.62,49.66 39.37,49.4
  Bottom 0.305: v25.91,41.02 v36.07,41.02 | v39.62,41.02 v39.62,50.16
N$5
  Top 0.305: IC1.62 25.19,43.56 | 25.19,43.56 25.19,44.83 C9.1 | 25.19,43.56 28.19,43.56 28.19,48.01 Q2.2
N$7
  Top 0.305: R9.2 | R9.2 4.32,9.02
  Top 0.61: P0.31.C 4.32,9.02
N$8
  Top 0.61: P-LED.C 6.12,55.22 6.35,54.99 R12.1
N$10
  Top 0.61: U$1.8 61.65,23.17 61.47,22.99 59.69,22.99 58.93,23.75 58.93,24 58.67,24.26 55.55,24.26 12M.2 55.5,20.34 C17.2
N$13  (via drill 0.3)
  Top 0.305: IC1.58 27.19,39.99 27.18,40 27.18,40.26 28.85,41.94 | R10.1 43.28,42.8 43.25,42.85 | 28.85,41.94 28.96,42.04 | R11.2 43.84,46.43 43.82,46.66 43.74,46.41 v43.48,46.61 | v43.2,43.81 43.2,42.93 43.25,42.85 | R11.2 | v39.68,39.06 41.89,39.06 41.91,39.09 41.91,40.51 43.1,40.51 43.13,40.54 43.13,42.77 43.25,42.85 | v36.37,33.91 v38.81,33.91 | v34.19,39.06 33.98,39.06 v33.98,42.24 | v28.75,42.24 28.75,42.04 28.85,41.94
  Bottom 0.305: v43.48,46.61 43.48,43.81 v43.2,43.81 | v39.68,39.06 39.68,35.23 38.94,35.23 38.91,35.2 38.91,33.91 v38.81,33.91 | v36.37,33.91 36.37,35.86 36.09,35.86 36.07,35.89 36.07,36.65 35.66,37.06 35.66,38.23 35.64,38.25 35.61,38.25 35.59,38.28 35.59,38.3 35.56,38.33 34.21,38.33 34.19,38.35 v34.19,39.06 | v33.98,42.24 33.98,42.04 28.78,42.04 28.75,42.06 v28.75,42.24
N$14
  Top 0.305: 60.82,24.37 60.81,24.38 12M.1
  Top 0.61: U$1.7 66.17,24.38 66.04,24.51 60.96,24.51 60.82,24.37 60.71,24.26 | C18.2 50.22,23.93 51.05,24.77 53.85,24.77 54.1,25.02 54.1,25.27 54.36,25.53 59.94,25.53 60.45,25.02 60.45,24.33 12M.1
N$18  (1 unrouted)
  Top 0.61: R3.1 17.02,51.18 17.53,51.69 17.53,54.48
N$20
  Top 0.61: SD.9 52.83,51.18 52.32,50.67 52.32,50.32 R18.1
N$25
  Top 0.61: SD.8 54.36,31.88 53.85,31.37 53.85,29.34 53.59,29.08 52.17,29.08 R16.1
N$35
  Top 1.93: 78.23,27.3 80.26,27.3
P05  (via drill 0.3)
  Top 0.305: IC1.29 30.19,12.61 30.48,12.32 v30.48,6.73
  Bottom 0.305: v30.48,6.73 34.04,6.73 34.29,6.48 34.29,2.92 34.04,2.67 33.02,2.67 ADD-ON.19
P06  (via drill 0.3)
  Top 0.305: IC1.30 30.69,12.87 30.99,12.57 30.99,7.75 v31.24,7.49
  Bottom 0.305: v31.24,7.49 36.58,7.49 36.83,7.24 36.83,2.92 36.58,2.67 35.69,2.67 ADD-ON.21
P07  (via drill 0.3)
  Top 0.305: IC1.31 31.19,13.13 31.5,12.83 31.5,8.51 v31.75,8.26
  Bottom 0.305: v31.75,8.26 39.12,8.26 39.37,8 39.37,2.67 39.12,2.41 38.23,2.41 ADD-ON.23
P11
  Top 0.305: 41.91,5.71 42.42,6.22 42.42,30.86 42.14,31.14 IC1.37
  Top 0.406: ADD-ON.25 41.78,2.54 41.91,2.67 41.91,5.71
P16  (via drill 0.3)
  Top 0.305: IC1.46 39.33,35.64 39.37,35.69 39.37,36.45 39.62,36.7 50.04,36.7 50.29,36.45 v50.29,35.94
  Bottom 0.305: 80.26,22.48 80.52,22.73 80.52,28.07 80.01,28.57 59.94,28.57 59.44,29.08 59.44,35.18 58.93,35.69 50.29,35.69 v50.29,35.94
  Bottom 0.406: 80.26,22.48 80.01,22.23 INT-0.2
P21  (via drill 0.3)
  Top 0.305: IC1.1 22.24,37.58 22.1,37.72 v16.51,37.72 | v16.26,32.89 v16.26,22.48 | v47.5,23.24 47.5,6.22 46.99,5.71
  Top 0.406: ADD-ON.29 46.61,2.54 46.99,2.92 46.99,5.71
  Bottom 0.305: v16.51,37.72 16.51,33.15 v16.26,32.89 | v16.26,22.48 16.76,22.99 47.24,22.99 v47.5,23.24
P22  (via drill 0.3)
  Top 0.305: 21.03,36.14 IC1.2 18.09,36.14 v17.53,36.7 | v17.27,32.64 v17.27,21.72 | v45.72,22.23 45.72,8.76 45.97,8.51 45.97,6.98 45.47,6.48 45.21,6.48 44.45,5.71
  Top 0.406: ADD-ON.27 44.07,2.54 44.45,2.92 44.45,5.71
  Bottom 0.305: v17.53,36.7 17.53,32.89 v17.27,32.64 | v17.27,21.72 17.53,21.97 | 17.53,21.97 17.27,21.97 | 17.53,21.97 45.47,21.97 v45.72,22.23
P25  (via drill 0.3)
  Top 0.305: IC1.28 29.69,25.4 | 29.69,25.4 29.69,25.3 | v29.72,12.06 29.72,25.27 29.67,25.4 29.69,25.4 | v33.27,11.81 33.27,5.33 ADD-ON.20
  Bottom 0.305: v29.72,12.06 33.02,12.06 v33.27,11.81
P31  (via drill 0.3)
  Top 0.305: IC1.17 24.19,26.35 v23.88,26.03 | v8.64,25.78 8.64,9.52 8.38,9.27 R9.1
  Bottom 0.305: v23.88,26.03 8.89,26.03 v8.64,25.78
R/W  (via drill 0.3)
  Top 0.305: IC1.26 28.69,28.56 28.96,28.83 31.24,28.83 v31.75,29.34 | v31.75,50.67 v22.61,50.67 | v32.26,40.26 v32.26,45.09
  Bottom 0.305: v31.75,29.34 32,29.59 32,39.5 v32.26,40.26 | 32,50.42 v31.75,50.67 32.26,50.16 v32.26,45.09 | v22.61,50.67 LCD.5
RL  (via drill 0.3)
  Top 0.305: IC1.32 31.69,13.4 32,13.08 32,9.27 v32.26,9.02 | v35.56,9.02 ADD-ON.22
  Bottom 0.305: v32.26,9.02 v35.56,9.02
RS  (via drill 0.3)
  Top 0.305: v26.67,12.57 26.69,12.59 IC1.22 26.69,29.32 26.42,29.59 26.42,30.1 v26.16,30.61 | v49.28,12.83 49.28,5.97 49.53,5.71 | v26.16,34.92 26.16,35.94 25.91,36.2 25.91,36.96 v25.65,37.21
  Top 0.406: ADD-ON.31 49.15,2.54 49.53,2.92 49.53,5.71
  Bottom 0.305: v26.67,12.57 26.92,12.83 v49.28,12.83 | v26.16,30.61 v26.16,34.92 | v25.65,37.21 20.83,37.21 20.32,37.72 20.32,41.78 20.83,42.29 20.83,51.44 20.07,52.2 LCD.4
RST  (via drill 0.3)
  Top 0.305: IC1.57 27.69,37.29 v27.41,37.29 | C19.1 42.9,38.48 42.14,37.72 36.37,37.72 v36.37,37.36 | v43.99,34.37 45.34,34.37 45.34,34.67 R15.2 | v22.45,39.32 23.75,40.61 v23.75,40.74 | v35.43,41.73 35.36,41.66 35.36,40.66 35.56,40.46 v35.56,39.06 | v41.71,28.8 v41.71,12.12
  Top 0.61: RESET.3 RESET.4 71.6,8.79 71.63,8.76
  Bottom 0.305: 41.71,28.93 42.27,28.93 43.99,30.66 v43.99,34.37 | 41.71,28.93 36.17,28.93 36.17,29.95 37.08,30.86 37.08,35.89 36.6,36.37 36.58,36.37 36.58,36.88 36.37,37.08 v36.37,37.36 36.3,37.49 36.3,38.33 v35.56,39.06 | v27.41,37.29 26.09,38.61 23.16,38.61 v22.45,39.32 | v23.75,40.74 24.74,41.73 28.25,41.73 28.45,41.53 35.23,41.53 v35.43,41.73 | RESET.3 65.48,9.45 65.48,12.12 v41.71,12.12 | v41.71,28.8 41.71,28.93
RSTW
  Top 0.305: WIFI.5 4.17,28.47 4.17,25.55 6.22,23.49 R2.2
RTCK  (via drill 0.3)
  Top 0.305: IC1.24 v27.69,6.48
  Bottom 0.305: v27.69,6.48 18.03,6.48 17.78,6.22 ADD-ON.8
RXD0  (via drill 0.3)
  Top 0.305: IC1.21 26.19,13.62 v25.91,13.59 | v72.52,19.1 U$1.2 | v72.52,15.67 73.2,14.99 73.2,8.31 72.03,7.14 67.41,7.14 67.41,5.89 67.31,5.71 | v62.23,13.46 62.38,13.31 62.38,1.42 64.85,1.42 65.86,2.44 ADD-ON.45
  Top 0.406: ADD-ON.45 67.18,2.54 67.31,2.67 67.31,5.71
  Bottom 0.305: v25.91,13.59 62.23,13.59 | 62.23,13.59 62.48,13.59 | v72.52,15.67 v72.52,19.1 | v62.23,13.46 62.23,13.59
RXD1  (via drill 0.3)
  Top 0.305: IC1.34 34.49,29.64 34.8,29.34 v34.8,26.8 | v7.37,26.8 7.37,33.15 7.11,33.4 3.3,33.4 3.05,33.66 WIFI.1 | COM2.2 13.56,29.49 13.56,26.9 v13.51,26.85
  Bottom 0.305: v34.8,26.8 13.51,26.8 | 13.51,26.8 v7.37,26.8 | v13.51,26.85 13.51,26.8
SCK1
  Top 0.305: SD.5 53.59,38.48 53.34,38.23 53.34,36.96 53.09,36.7 51.05,36.7 50.55,37.21 38.86,37.21 38.61,36.96 38.61,36.45 38.3,36.14 IC1.47
SSEL1
  Top 0.305: IC1.55 28.69,39.99 28.7,40 28.7,41.02 29.46,41.78 29.46,47.37 36.32,47.37 36.58,47.62 36.58,48.64
  Top 0.406: SD.1 36.58,48.64
TCK  (via drill 0.3)
  Top 0.305: IC1.56 28.19,37.29 v28.42,37.29 | v23.47,39.32 24.46,40.31 v24.46,42.39 | v34.72,40.31 v34.72,42.95 | v36.37,40.11 37.41,39.06 v38.56,39.06 | v36.88,29.64 37.08,29.44 37.08,19.18 36.12,18.21 34.9,18.21 v34.9,18.87 | v23.44,18.36 23.42,18.34 23.42,11.41 | 23.42,11.41 23.42,9.98 KBD.2 | 23.42,11.41 20.85,11.41 20.22,10.77 20.22,7.16 21.49,5.89 21.59,5.71
  Top 0.406: ADD-ON.9 21.21,2.54 21.59,2.92 21.59,5.71
  Bottom 0.305: v28.42,37.29 26.39,39.32 v23.47,39.32 | v24.46,42.39 25.02,42.95 v34.72,42.95 | v34.72,40.31 34.93,40.11 v36.37,40.11 | v38.56,39.06 38.56,35.59 38.1,35.13 38.1,30.86 38.3,30.66 38.3,29.64 v36.88,29.64 | v34.9,18.87 34.7,19.08 24.16,19.08 v23.44,18.36
TDI  (via drill 0.3)
  Top 0.305: IC1.60 26.19,39.52 26.42,39.75 v26.42,40.03 | v15.7,40.03 v21.03,40.03 | v10.95,39.75 v10.95,41.22 | v9.32,28.83 10.72,27.43 v10.72,16.1 | KBD.3 21.34,8.59 24.03,5.89 24.13,5.71
  Top 0.406: ADD-ON.11 23.75,2.54 24.13,2.92 24.13,5.71
  Bottom 0.305: v21.03,40.03 v26.42,40.03 | v15.7,40.03 14.5,41.22 v10.95,41.22 | v10.95,39.75 13.56,37.13 13.56,29.95 10.44,29.95 v9.32,28.83 | v10.72,16.1 15.42,11.41 19.46,11.41 KBD.3
TDO  (via drill 0.3)
  Top 0.305: IC1.64 15.89,38.59 v15.75,38.73 | v15.24,32.89 15.24,21.97 17.27,19.94 17.27,19.18 19.05,17.4 19.05,9.78 KBD.4 17.78,9.52 17.53,9.27 17.53,7.49 17.27,7.24 17.02,7.24 16.51,6.73 16.51,5.46 16.13,5.08 ADD-ON.6
  Bottom 0.305: v15.75,38.73 15.75,33.66 v15.24,32.89
TMS  (via drill 0.3)
  Top 0.305: IC1.52 30.19,37.94 29.72,37.47 29.72,36.2 29.46,35.94 29.46,31.37 v23.62,31.37 | v11.43,3.68 11.43,24.51 11.94,25.02 13.72,25.02 14.22,25.53 14.22,28.07 v14.48,28.32
  Bottom 0.305: ADD-ON.7 17.78,1.42 | 17.78,1.42 17.78,1.14 18.29,0.89 28.7,0.89 29.21,1.4 29.21,8.51 28.96,8.76 26.42,8.76 26.16,9.02 26.16,9.27 KBD.1 | v11.43,3.68 11.43,1.42 17.78,1.42 | v14.48,28.32 23.37,28.32 23.62,28.57 v23.62,31.37
TRST
  Top 0.305: IC1.20 25.69,14.64 25.15,14.1 25.15,7.24 26.42,7.24 26.67,6.98 26.67,1.4 26.42,1.14 10.41,1.14 10.16,1.4 ADD-ON.1
TXD0  (via drill 0.3)
  Top 0.305: IC1.19 25.19,14.9 24.64,14.35 24.64,12.06 v24.13,11.56 | v71.25,19.1 U$1.3 | v64.77,10.8 64.77,10.72 67.16,10.72 67.16,10.19 67.31,10.03 68.83,10.03 69.09,10.29 69.09,15.37 69.34,15.62 71.37,15.62 71.35,15.6 v71.25,15.6
  Bottom 0.305: v24.13,11.56 24.38,11.3 32.51,11.3 32.77,11.05 60.96,11.05 | 60.96,11.05 64.52,11.05 v64.77,10.8 | v71.25,15.6 v71.25,19.1 | ADD-ON.43 62.08,3.96 62.08,8.43 61.8,8.43 60.96,9.27 60.96,11.05
TXD1  (via drill 0.3)
  Top 0.305: IC1.33 33.64,27.67 v33.53,27.56
  Bottom 0.305: v33.53,27.56 11.68,27.56 | 11.68,27.56 6.1,27.56 WIFI.8 | 11.68,27.56 COM2.1
Y
  Top 1.93: 78.74,56.01 80.52,56.01

### Text on the board
Top: R15 Shorted with ISP line
tPlace: EMTRON
tNames: 1 | * | 1 | * | 1 | 1 | 1 | ISP ON | 1 | LPC-ARM- PIGGYBACK | 50 | 1 | 3 | 5 | 7 | 9 | 11 | 13 | 15 | 17 | 19 | 21 | 23 | 25 | 27 | 29 | 31 | 33 | 35 | 37 | 39 | 41 | 43 | 45 | 47 | 49
tValues: 1 | 6